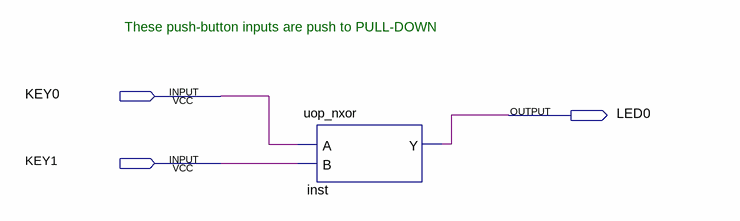
[diagram p0: schematic sheet]
// Quartus schematic comb_logic.bdf as structural Verilog: 1 symbols, 3 pins
module comb_logic (
  input  KEY0,
  input  KEY1,
  output LED0
);

  uop_nxor inst (.A(KEY0), .B(KEY1), .Y(LED0));

  // Notes on the sheet:
  //   These push-button inputs are push to PULL-DOWN
endmodule
